# Altium schematic sheet Bluetooth_BLUE.SchDoc
size A4
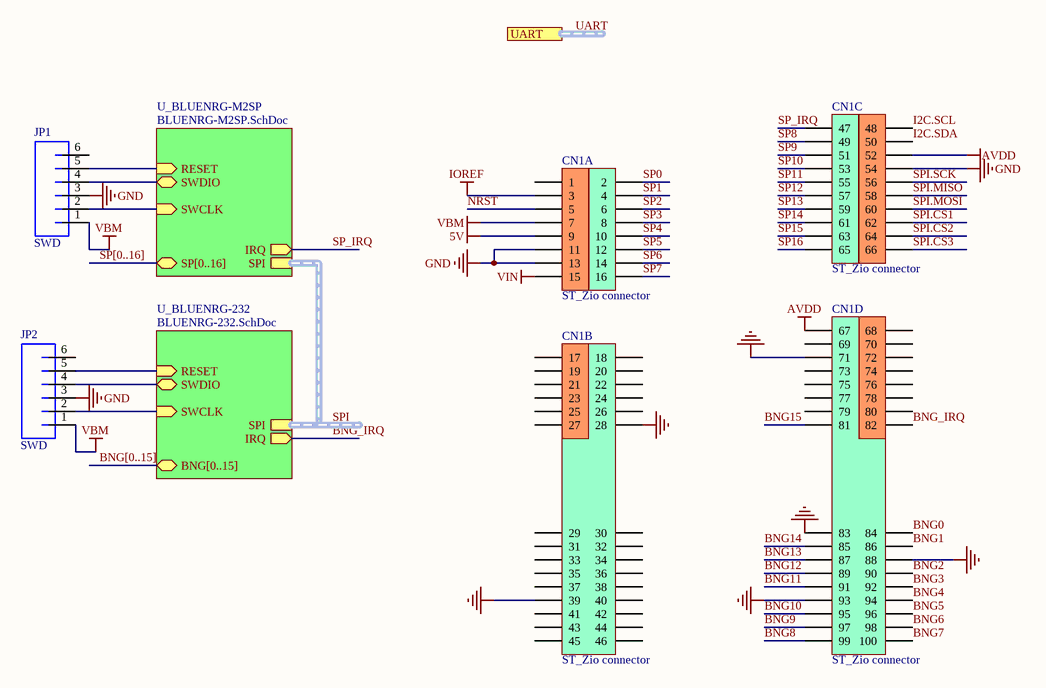
[diagram p0: Bluetooth_BLUE.SchDoc]

## Parts
CN1  ST_Zio connector  [ST_Zio]  (parts A,B,C,D of 4)
JP1  SWD  [MOLEX_5045_6]
JP2  SWD  [MOLEX_5045_6]

## Sub-sheets
U_BLUENRG-232 = BLUENRG-232.SchDoc: BNG[0..15] (bidir), IRQ (out), RESET (in), SWCLK (in), SWDIO (bidir), SPI (harness SPI)
U_BLUENRG-M2SP = BLUENRG-M2SP.SchDoc: IRQ (out), RESET (in), SWCLK (in), SWDIO (bidir), SPI (harness SPI), SP[0..16] (bidir)

## Ports
UART (harness USART2)

## Nets
5V: CN1.9
AVDD: CN1.52 CN1.67
GND: CN1.11 CN1.13 CN1.28 CN1.39 CN1.54 CN1.71 CN1.83 CN1.88 CN1.93 JP1.3 JP2.3
IOREF: CN1.3
VBM: CN1.7 JP1.1 JP2.1
VIN: CN1.15
BNG0: CN1.84
BNG1: CN1.86
BNG2: CN1.90
BNG3: CN1.92
BNG4: CN1.94
BNG5: CN1.96
BNG6: CN1.98
BNG7: CN1.100
BNG8: CN1.99
BNG9: CN1.97
BNG10: CN1.95
BNG11: CN1.91
BNG12: CN1.89
BNG13: CN1.87
BNG14: CN1.85
BNG15: CN1.81
BNG_IRQ: CN1.82 ; sheet U_BLUENRG-232/IRQ
I2C.SCL: CN1.48
I2C.SDA: CN1.50
NRST: CN1.5
SP0: CN1.2
SP1: CN1.4
SP2: CN1.6
SP3: CN1.8
SP4: CN1.10
SP5: CN1.12
SP6: CN1.14
SP7: CN1.16
SP8: CN1.49
SP9: CN1.51
SP10: CN1.53
SP11: CN1.55
SP12: CN1.57
SP13: CN1.59
SP14: CN1.61
SP15: CN1.63
SP16: CN1.65
SP_IRQ: CN1.47 ; sheet U_BLUENRG-M2SP/IRQ
SPI.CS1: CN1.62
SPI.CS2: CN1.64
SPI.CS3: CN1.66
SPI.MISO: CN1.58
SPI.MOSI: CN1.60
SPI.SCK: CN1.56
NetJP1_2: JP1.2 ; sheet U_BLUENRG-M2SP/SWCLK
NetJP1_4: JP1.4 ; sheet U_BLUENRG-M2SP/SWDIO
NetJP1_5: JP1.5 ; sheet U_BLUENRG-M2SP/RESET
NetJP2_2: JP2.2 ; sheet U_BLUENRG-232/SWCLK
NetJP2_4: JP2.4 ; sheet U_BLUENRG-232/SWDIO
NetJP2_5: JP2.5 ; sheet U_BLUENRG-232/RESET

Not connected (* = marked no-connect by the designer): CN1 1 17 18 19 20 21 22 23 24 25 26 27 29 30 31 32 33 34 35 36 37 38 40 41 42 43 44 45 46 68 69 70 72 73 74 75 76 77 78 79 80; JP1 6; JP2 6

## Buses and harness runs
bus BNG[0..15] = sheet U_BLUENRG-232/BNG[0..15]
bus SP[0..16] = sheet U_BLUENRG-M2SP/SP[0..16]
harness SPI = sheet U_BLUENRG-232/SPI = sheet U_BLUENRG-M2SP/SPI
harness UART = port UART

## Library data of the parts
JP1 JP2 = MOLEX_5045_6: PartNumber: B6B-PH-K-S(LF)(SN); Manufacturer: JST Sales America Inc.; PackageReference: JST-PH; Mounting Technology: Through Hole